# Altium schematic sheet Schematic.SchDoc
size A4; SheetNumber: 1; SheetTotal: 1
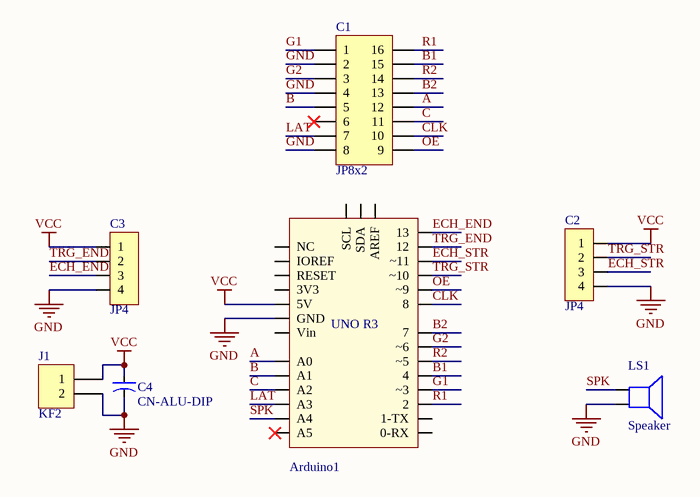
[diagram p0: Schematic.SchDoc]

## Parts
Arduino1  Arduino Uno R3  [Arduino UNO R3]  (value not drawn)
C1  JP8x2  [JP8-C2T]
C2  JP4  [JP4-C1T]
C3  JP4  [JP4-C1T]
C4  CN-ALU-DIP  [CA-ALU-2.54]
J1  KF2  [KF2-3.5]
LS1  Speaker  [SPEAKER]

## Nets
GND: Arduino1.GND C1.2 C1.4 C1.8 C2.4 C3.4 C4.2 J1.2 LS1.2
VCC: Arduino1.5V C2.1 C3.1 C4.1 J1.1
A: Arduino1.A0 C1.12
B: Arduino1.A1 C1.5
B1: Arduino1.4 C1.15
B2: Arduino1.7 C1.13
C: Arduino1.A2 C1.11
CLK: Arduino1.8 C1.10
ECH_END: Arduino1.13 C3.3
ECH_STR: Arduino1.~11 C2.3
G1: Arduino1.~3 C1.1
G2: Arduino1.~6 C1.3
LAT: Arduino1.A3 C1.7
OE: Arduino1.~9 C1.9
R1: Arduino1.2 C1.16
R2: Arduino1.~5 C1.14
SPK: Arduino1.A4 LS1.1
TRG_END: Arduino1.12 C3.2
TRG_STR: Arduino1.~10 C2.2

Not connected (* = marked no-connect by the designer): Arduino1 0-RX 1-TX 3V3 A5* AREF IOREF NC RESET SCL SDA Vin; C1 6*

## Notes on the sheet
- (in symbol Arduino Uno R3) UNO R3

## Library data of the parts
Arduino1 = Arduino Uno R3: Value: Cau 1A
C1 = JP8x2: WR-PHD 2.54 mm Dual Socket Header; Manufacturer: W¨¹rth Elektronik eiSos GmbH; partNo: 61301621821; ComponentLink1 Description: Manufacturer; ComponentLink2 Description: Datasheet; NoPins: 16; Created Date: 29 March 2013; ComponentLink1URL: http://www.we-online.com; ComponentLink2URL: http://katalog.we-online.de/em/datasheet/6130xx21821.pdf; Created by: Karrer Zheng
C2 C3 = JP4: WR-PHD 2.54 mm Angled Socket Header; Manufacturer: W¨¹rth Elektronik eiSos GmbH; partNo: 613004143121; ComponentLink1 Description: Manufacturer; ComponentLink2 Description: Datasheet; NoPins: 04; Created Date: 29 March 2013; ComponentLink1URL: http://www.we-online.com; ComponentLink2URL: http://katalog.we-online.de/em/datasheet/6130xx143121.pdf; Created by: Karrer Zheng
C4 = CN-ALU-DIP: Capacitor (Semiconductor SIM Model); Value: 104; LatestRevisionDate: 17-Jul-2002; LatestRevisionNote: Re-released for DXP Platform.; PackageReference: C1206; Publisher: Altium Limited
J1 = KF2: Manufacturer: Würth Elektronik eiSos GmbH; partNo: 691103110002; ComponentLink1 Description: Manufacturer; ComponentLink2 Description: Datasheet; NoPins: 2; Created Date: 29 October 2013; ComponentLink1URL: http://www.we-online.com; ComponentLink2URL: http://katalog.we-online.de/em/datasheet/6911031100xx.pdf; Created by: Karrer Zheng
LS1 = Speaker: Loudspeaker; Published: 24-Mar-1999; LatestRevisionDate: 17-Jul-2002; LatestRevisionNote: Re-released for DXP Platform.; PackageReference: PIN2; Publisher: Altium Limited